# Altium schematic sheet TEMP_SCH.SchDoc
size A4
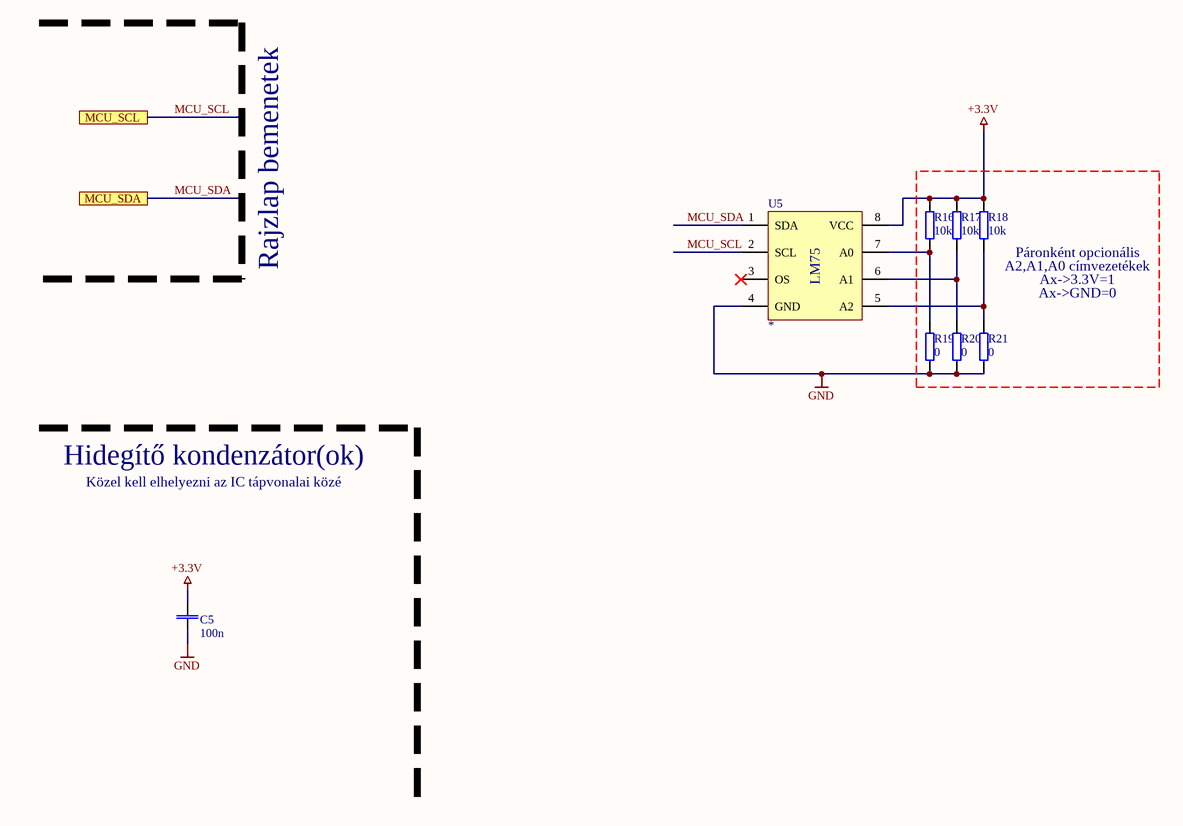
[diagram p0: TEMP_SCH.SchDoc]

## Parts
C5  100n  [CAP 0805]
R16  10k  [RES 0805]
R17  10k  [RES 0805]
R18  10k  [RES 0805]
R19  0  [RES 0805]
R20  0  [RES 0805]
R21  0  [RES 0805]
U5  *  [SO8]

## Ports
MCU_SCL, MCU_SDA

## Nets
+3.3V: C5.2 R16.2 R17.2 R18.2 U5.8(VCC)
GND: C5.1 R19.1 R20.1 R21.1 U5.4(GND)
MCU_SCL: U5.2(SCL) ; port MCU_SCL
MCU_SDA: U5.1(SDA) ; port MCU_SDA
NetR16_1: R16.1 R19.2 U5.7(A0)
NetR17_1: R17.1 R20.2 U5.6(A1)
NetR18_1: R18.1 R21.2 U5.5(A2)

Not connected (* = marked no-connect by the designer): U5 3(OS)*

## Notes on the sheet
- Rajzlap bemenetek
- (near R18) Páronként opcionális
- (near R18) A2,A1,A0 címvezetékek
- Ax->3.3V=1
- Ax->GND=0
- Hidegítő kondenzátor(ok)
- Közel kell elhelyezni az IC tápvonalai közé

## Library data of the parts
C5 = CAP: NON POLARIZED CAPACITOR; VALUE: 100n; Reference: 82-10-76; Supplier: Lomex
R16-R21 = RES: RESISTOR; Supplier: Lomex
  R16-R18: Reference: 81-10-99; VALUE: 10k
  R19-R21: Reference: 81-10-02; VALUE: 0
U5 = LM75: Temperature sensor with I2C interface; Supplier: *; Reference: *; VALUE: *